# Altium schematic sheet Button Decoding.SchDoc: Audio_Moduloop - Decoders
size A; Date: 2/27/2024; DrawnBy: Team 28: Ryan Gordon, Conor Curtin, Evan Roveili, Shawn Colby; DocumentNumber: 8; Revision: V1; SheetNumber: 8; SheetTotal: 9
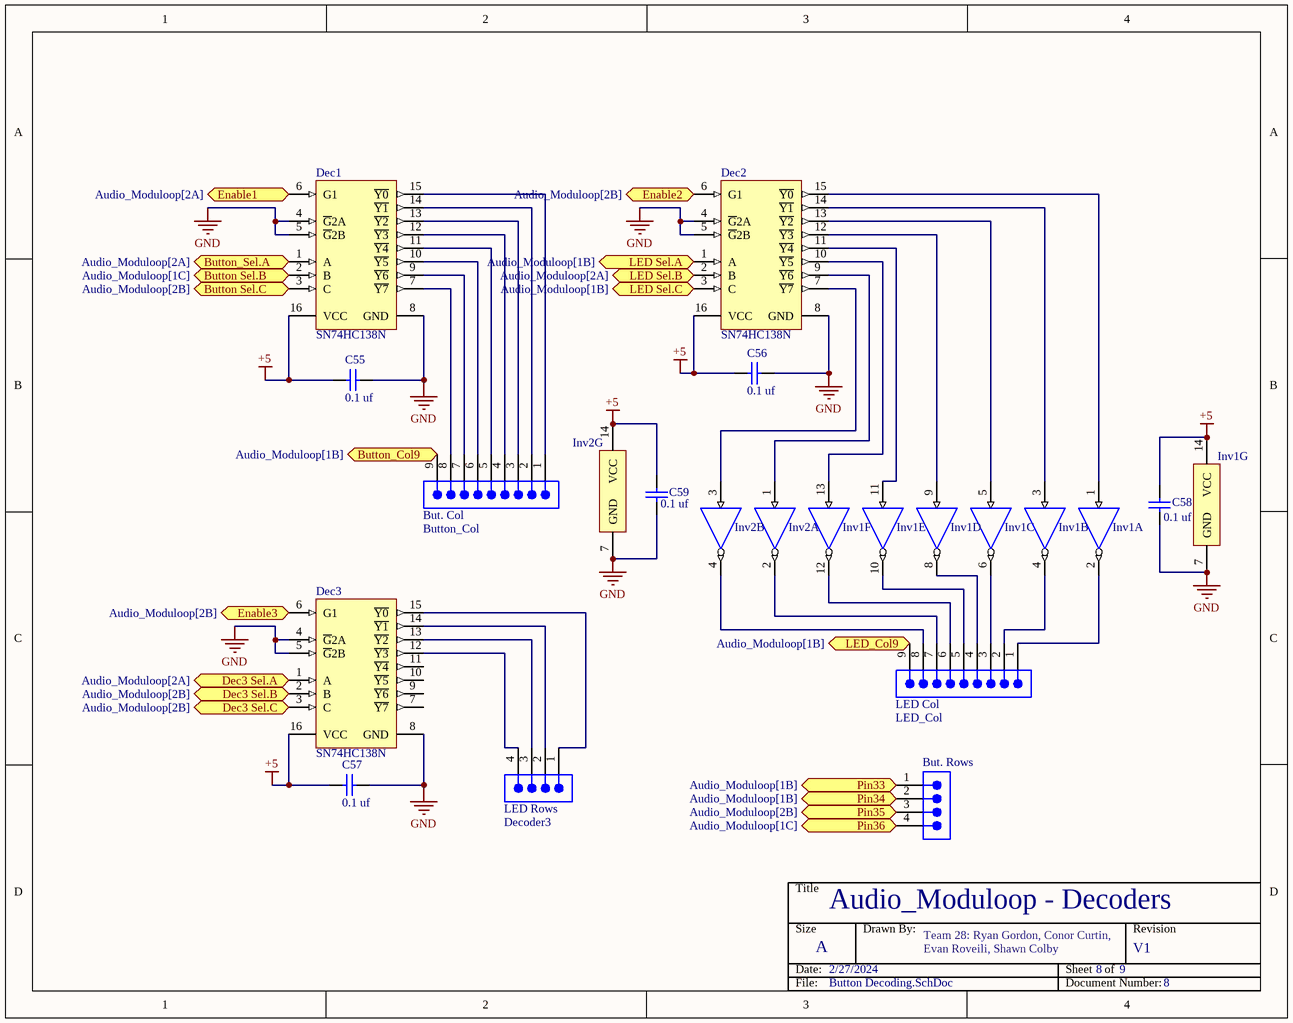
[diagram p0: Button Decoding.SchDoc]

## Parts
But._Col  Button_Col  [61300911121]
But._Rows  61300411121  [61300411121]  (value not drawn)
C55  0.1 uf  [CAPC2013X135X45ML10T25]
C56  0.1 uf  [CAPC2013X135X45ML10T25]
C57  0.1 uf  [CAPC2013X135X45ML10T25]
C58  0.1 uf  [CAPC2013X135X45ML10T25]
C59  0.1 uf  [CAPC2013X135X45ML10T25]
Dec1  SN74HC138N  [N0016A]
Dec2  SN74HC138N  [N0016A]
Dec3  SN74HC138N  [N0016A]
Inv1  Inv1  [N0014A]  (value not drawn)  (parts A,B,C,D,E,F,G of 7)
Inv2  Inv2  [N0014A]  (value not drawn)  (parts A,B,G of 7)
LED_Col  LED_Col  [61300911121]
LED_Rows  Decoder3  [61900411121]

## Ports
Button Sel.B (bidir, see Audio_Moduloop[1C]), Button Sel.C (bidir, see Audio_Moduloop[2B]), Button_Col9 (bidir, see Audio_Moduloop[1B]), Button_Sel.A (bidir, see Audio_Moduloop[2A]), Dec3 Sel.A (bidir, see Audio_Moduloop[2A]), Dec3 Sel.B (bidir, see Audio_Moduloop[2B]), Dec3 Sel.C (bidir, see Audio_Moduloop[2B]), Enable1 (bidir, see Audio_Moduloop[2A]), Enable2 (bidir, see Audio_Moduloop[2B]), Enable3 (bidir, see Audio_Moduloop[2B]), LED Sel.A (bidir, see Audio_Moduloop[1B]), LED Sel.B (bidir, see Audio_Moduloop[2A]), LED Sel.C (bidir, see Audio_Moduloop[1B]), LED_Col9 (bidir, see Audio_Moduloop[1B]), Pin33 (bidir, see Audio_Moduloop[1B]), Pin34 (bidir, see Audio_Moduloop[1B]), Pin35 (bidir, see Audio_Moduloop[2B]), Pin36 (bidir, see Audio_Moduloop[1C])

## Nets
+5: C55.2 C56.2 C57.2 C58.1 C59.1 Dec1.16(VCC) Dec2.16(VCC) Dec3.16(VCC) Inv1.14(VCC) Inv2.14(VCC)
GND: C55.1 C56.1 C57.1 C58.2 C59.2 Dec1.4(~{G}2A) Dec1.5(~{G}2B) Dec1.8(GND) Dec2.4(~{G}2A) Dec2.5(~{G}2B) Dec2.8(GND) Dec3.4(~{G}2A) Dec3.5(~{G}2B) Dec3.8(GND) Inv1.7(GND) Inv2.7(GND)
Button Sel.B: Dec1.2(B) ; port Button Sel.B
Button Sel.C: Dec1.3(C) ; port Button Sel.C
Button_Col9: But._Col.9 ; port Button_Col9
Button_Sel.A: Dec1.1(A) ; port Button_Sel.A
Dec3 Sel.A: Dec3.1(A) ; port Dec3 Sel.A
Dec3 Sel.B: Dec3.2(B) ; port Dec3 Sel.B
Dec3 Sel.C: Dec3.3(C) ; port Dec3 Sel.C
Enable1: Dec1.6(G1) ; port Enable1
Enable2: Dec2.6(G1) ; port Enable2
Enable3: Dec3.6(G1) ; port Enable3
LED Sel.A: Dec2.1(A) ; port LED Sel.A
LED Sel.B: Dec2.2(B) ; port LED Sel.B
LED Sel.C: Dec2.3(C) ; port LED Sel.C
LED_Col9: LED_Col.9 ; port LED_Col9
Pin33: But._Rows.1 ; port Pin33
Pin34: But._Rows.2 ; port Pin34
Pin35: But._Rows.3 ; port Pin35
Pin36: But._Rows.4 ; port Pin36
NetBut._Col_1: But._Col.1 Dec1.15(~{Y0})
NetBut._Col_2: But._Col.2 Dec1.14(~{Y1})
NetBut._Col_3: But._Col.3 Dec1.13(~{Y2})
NetBut._Col_4: But._Col.4 Dec1.12(~{Y3})
NetBut._Col_5: But._Col.5 Dec1.11(~{Y4})
NetBut._Col_6: But._Col.6 Dec1.10(~{Y5})
NetBut._Col_7: But._Col.7 Dec1.9(~{Y6})
NetBut._Col_8: But._Col.8 Dec1.7(~{Y7})
NetDec2_7: Dec2.7(~{Y7}) Inv2.3(2A)
NetDec2_9: Dec2.9(~{Y6}) Inv2.1(1A)
NetDec2_10: Dec2.10(~{Y5}) Inv1.13(6A)
NetDec2_11: Dec2.11(~{Y4}) Inv1.11(5A)
NetDec2_12: Dec2.12(~{Y3}) Inv1.9(4A)
NetDec2_13: Dec2.13(~{Y2}) Inv1.5(3A)
NetDec2_14: Dec2.14(~{Y1}) Inv1.3(2A)
NetDec2_15: Dec2.15(~{Y0}) Inv1.1(1A)
NetDec3_12: Dec3.12(~{Y3}) LED_Rows.4
NetDec3_13: Dec3.13(~{Y2}) LED_Rows.3
NetDec3_14: Dec3.14(~{Y1}) LED_Rows.2
NetDec3_15: Dec3.15(~{Y0}) LED_Rows.1
NetInv1_2: Inv1.2(~{1Y}) LED_Col.1
NetInv1_4: Inv1.4(~{2Y}) LED_Col.2
NetInv1_6: Inv1.6(~{3Y}) LED_Col.3
NetInv1_8: Inv1.8(~{4Y}) LED_Col.4
NetInv1_10: Inv1.10(~{5Y}) LED_Col.5
NetInv1_12: Inv1.12(~{6Y}) LED_Col.6
NetInv2_2: Inv2.2(~{1Y}) LED_Col.7
NetInv2_4: Inv2.4(~{2Y}) LED_Col.8

Not connected (* = marked no-connect by the designer): Dec3 7(~{Y7}) 9(~{Y6}) 10(~{Y5}) 11(~{Y4})

## Notes on the sheet
- Title
- Size
- Date:
- A
- Drawn By:
- Sheet    of
- Revision
- File:
- Document Number:

## Library data of the parts
But._Col LED_Col = CMP-1502-01080-2: NexarPartId: 32855536; Number of Contacts: 9; Current Rating: 3A; Operating Supply Voltage: 250V; Connector Type: Male Pin; Gender: Male; Contact Resistance: 20mΩ; Pitch: 2.54mm; Number of Rows: 1; Number of Pins: 9; Termination: Solder; REACH SVHC: Unknown; Orientation: Vertical; Contact Plating: Gold; Mount: Through Hole; RoHS: Compliant; Number of Positions: 9; Color: Black; Lead Pitch: 2.54mm; Packaging: Bulk; Contact Mating Length: 5.9944mm; Contact Material: Copper
But._Rows = CMP-1502-01064-2: NexarPartId: 32855522; Pitch: 2.54mm; Number of Contacts: 4; Contact Resistance: 20mΩ; Gender: Male; Current Rating: 3A; Connector Type: Male Pin; Voltage Rating: 250V; Lead Free: Lead Free; Contact Plating: Gold; Max Operating Temperature: 105°C; Packaging: Bulk; Height: 8.89mm; Orientation: Vertical; Contact Mating Length: 5.9944mm; Contact Material: Copper; Lead Pitch: 2.54mm; Min Operating Temperature: -40°C; Termination: Solder; Color: Black; Number of Rows: 1; REACH SVHC: Unknown; RoHS: Compliant; Mount: Through Hole; Number of Positions: 4; Number of Pins: 4; Operating Supply Voltage: 250V
C55-C59 = CMP-2100-03644-1: Chip Capacitor, 0.1 uF, +/- 10%, 50 V, -55 to 125 degC, 0805 (2012 Metric), RoHS, Tape and Reel; Manufacturer: Murata; Voltage: 50V; Capacitance: 100nF; Insulation Resistance: 10GR; Dielectric Material: Ceramic; Dielectric: X7R; Package Description: 2-Pin Surface Mount Device, Body 2 x 1.25 mm; Manufacturer URL: http://www.murata.com/; Case Code (Imperial): 0805; Datasheet URL: http://psearch.en.murata.com/capacitor/product/GRM21BR71H104KA01%23.pdf; Termination: SMD/SMT; Lead Free: LeadFree; Package Quantity: 1; Mount: SurfaceMount; REACH SVHC: Unknown; Thickness: 0.053inch; Height: 1.25mm; Case/Package: 0805; Voltage Rating: 50V; Width: 0.049inch; Case Code (Metric): 2012; Material: Ceramic; Min Operating Temperature: -55degC; RoHSCompliant: true; Datasheet Version: 42675.0; Voltage Rating (DC): 50V; Tolerance: 10%; Package Reference: 0805; Depth: 1.25mm; Length: 2mm; Max Operating Temperature: 125degC; Packaging: TapeandReel; Number of Pins: 2; Radiation Hardening: No
Dec1-Dec3 = CMP-1633-00627-2: 3-Line To 8-Line Decoders/Demultiplexers, N0016A, TUBE; Manufacturer: Texas Instruments; Bits(#): 8; Function: Decoder/Demultiplexer; F @ Nom Voltage(Max)(Mhz): 28; Input Type: LVTTL/CMOS; VCC(Min)(V): 2; VCC(Max)(V): 6; Technology Family: HC; Rating: Catalog; Schmitt Trigger: No; Voltage(Nom)(V): 3.3,5; Output Type: CMOS; Channels(#): 1; Output Drive (IOL/IOH)(Max)(mA): 5.2/-5.2; ICC @ Nom Voltage(Max)(mA): 0.08; tpd @ Nom Voltage(Max)(ns): 45; Configuration: 3：8; DatasheetVersion: SCLS107E; Type: Standard; PackageReference: N0016A; Generic Part Number: SN74HC138; Code_JEDEC: MS-001; Operating Temperature Range(C): -40 to 85
Inv1 Inv2 = CMP-1615-00892-2: Hex Inverters, N0014A, TUBE; Manufacturer: Texas Instruments; Generic Part Number: SN74HC04; VCC(Min)(V): 2; Bits(#): 6; Technology Family: HC; tpd @ Nom Voltage(Max)(ns): 20; Output Drive (IOL/IOH)(Max)(mA): -4/4; Rating: Catalog; Voltage(Nom)(V): 5; Schmitt Trigger: No; ICC @ Nom Voltage(Max)(mA): 0.02; Input Type: CMOS; Code_JEDEC: MS-001; PackageReference: N0014A; DatasheetVersion: SCLS078F; Output Type: CMOS; VCC(Max)(V): 6; Operating Temperature Range(C): -40 to 85; F @ Nom Voltage(Max)(Mhz): 20
LED_Rows = CMP-1502-00586-2: NexarPartId: 18818226; Connector Type: Male Pin; Insulation: Insulated; Number of Positions: 4; Gender: Male; Operating Supply Voltage: 250V; Pitch: 2.54mm; Current Rating: 3A; Insulation Resistance: 1GΩ; Contact Resistance: 20mΩ; Termination: Through Hole; Contact Material: Copper; Height: 3.3mm; Width: 10.2mm; RoHS: Compliant; REACH SVHC: Unknown; Max Operating Temperature: 105°C; Contact Plating: Tin; Lead Free: Lead Free; Contact Gender: Male; Lead Pitch: 2.54mm; Flammability Rating: UL94 V-0; Packaging: Bulk; Housing Material: Nylon; Number of Pins: 4; Number of Contacts: 4; Color: Beige; Number of Rows: 1; Orientation: Vertical; Contact Mating Length: 7.493mm; Mount: Through Hole; Min Operating Temperature: -40°C; Voltage Rating: 250V; Fastening Type: Friction; Length: 10.16mm